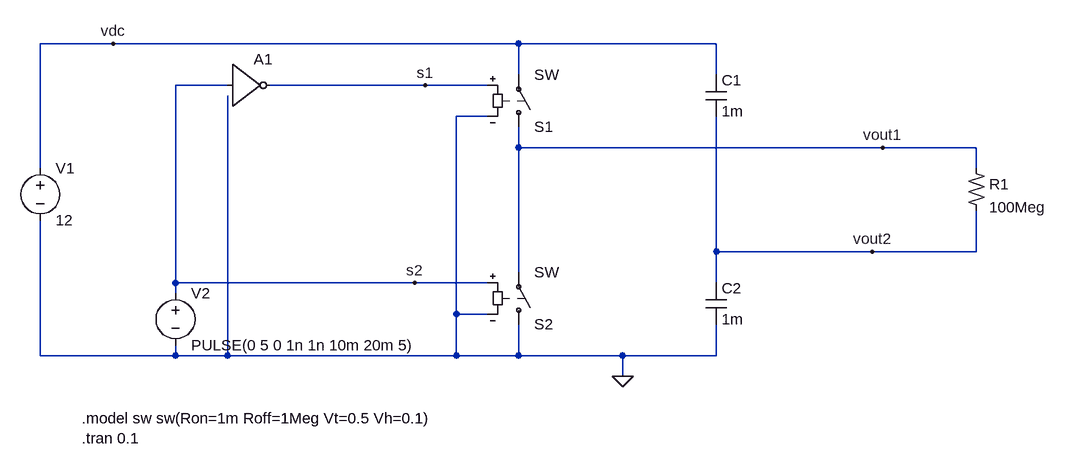
[diagram p0: schematic single-phase-inverter_v0p0.asc]
single-phase-inverter_v0p0.asc, the LTspice schematic file:
Version 4
SHEET 1 1828 716
WIRE -256 80 -368 80
WIRE 368 80 -256 80
WIRE 672 80 368 80
WIRE 368 128 368 80
WIRE 672 128 672 80
WIRE -80 144 -160 144
WIRE 224 144 -16 144
WIRE 320 144 224 144
WIRE 320 192 272 192
WIRE 368 240 368 208
WIRE 928 240 368 240
WIRE 1072 240 928 240
WIRE -368 272 -368 80
WIRE 1072 272 1072 240
WIRE 672 400 672 192
WIRE 912 400 672 400
WIRE 1072 400 1072 336
WIRE 1072 400 912 400
WIRE 368 432 368 240
WIRE -160 448 -160 144
WIRE 208 448 -160 448
WIRE 320 448 208 448
WIRE 672 448 672 400
WIRE -160 464 -160 448
WIRE 272 496 272 192
WIRE 320 496 272 496
WIRE -368 560 -368 352
WIRE -160 560 -160 544
WIRE -160 560 -368 560
WIRE -80 560 -80 160
WIRE -80 560 -160 560
WIRE 272 560 272 496
WIRE 272 560 -80 560
WIRE 368 560 368 512
WIRE 368 560 272 560
WIRE 528 560 368 560
WIRE 672 560 672 512
WIRE 672 560 528 560
WIRE 528 592 528 560
FLAG 224 144 s1
FLAG 208 448 s2
FLAG -256 80 vdc
FLAG 928 240 vout1
FLAG 912 400 vout2
FLAG 528 592 0
SYMBOL sw 368 224 M180
SYMATTR InstName S1
SYMATTR SpiceModel sw
SYMBOL sw 368 528 M180
SYMATTR InstName S2
SYMATTR SpiceModel sw
SYMBOL cap 656 128 R0
SYMATTR InstName C1
SYMATTR Value 1m
SYMATTR SpiceLine Rser=1m Rpar=10Meg
SYMBOL cap 656 448 R0
SYMATTR InstName C2
SYMATTR Value 1m
SYMATTR SpiceLine Rser=1m Rpar=10Meg
SYMBOL voltage -368 256 R0
SYMATTR InstName V1
SYMATTR Value 12
SYMATTR SpiceLine Rser=1m
SYMBOL res2 1056 272 R0
SYMATTR InstName R1
SYMATTR Value 100Meg
SYMBOL voltage -160 448 R0
SYMATTR InstName V2
SYMATTR Value PULSE(0 5 0 1n 1n 10m 20m 5)
SYMBOL Digital/inv -80 80 R0
WINDOW 3 8 54 Left 2
SYMATTR InstName A1
SYMATTR SpiceLine VHIGH = 5
TEXT -304 656 Left 2 !.model sw sw(Ron=1m Roff=1Meg Vt=0.5 Vh=0.1)\n.tran 0.1

The netlist it stands for:
* single-phase-inverter_v0p0.asc
S1 vout1 vdc s1 0 sw SW
S2 0 vout1 s2 0 sw SW
C1 vdc vout2 1m Rser=1m Rpar=10Meg
C2 vout2 0 1m Rser=1m Rpar=10Meg
V1 vdc 0 12 Rser=1m
R1 vout1 vout2 100Meg
V2 s2 0 PULSE(0 5 0 1n 1n 10m 20m 5)
A1 s2 0 0 0 0 s1 0 0 BUF VHIGH = 5
.model sw sw(Ron=1m Roff=1Meg Vt=0.5 Vh=0.1)
.tran 0.1
.backanno
.end